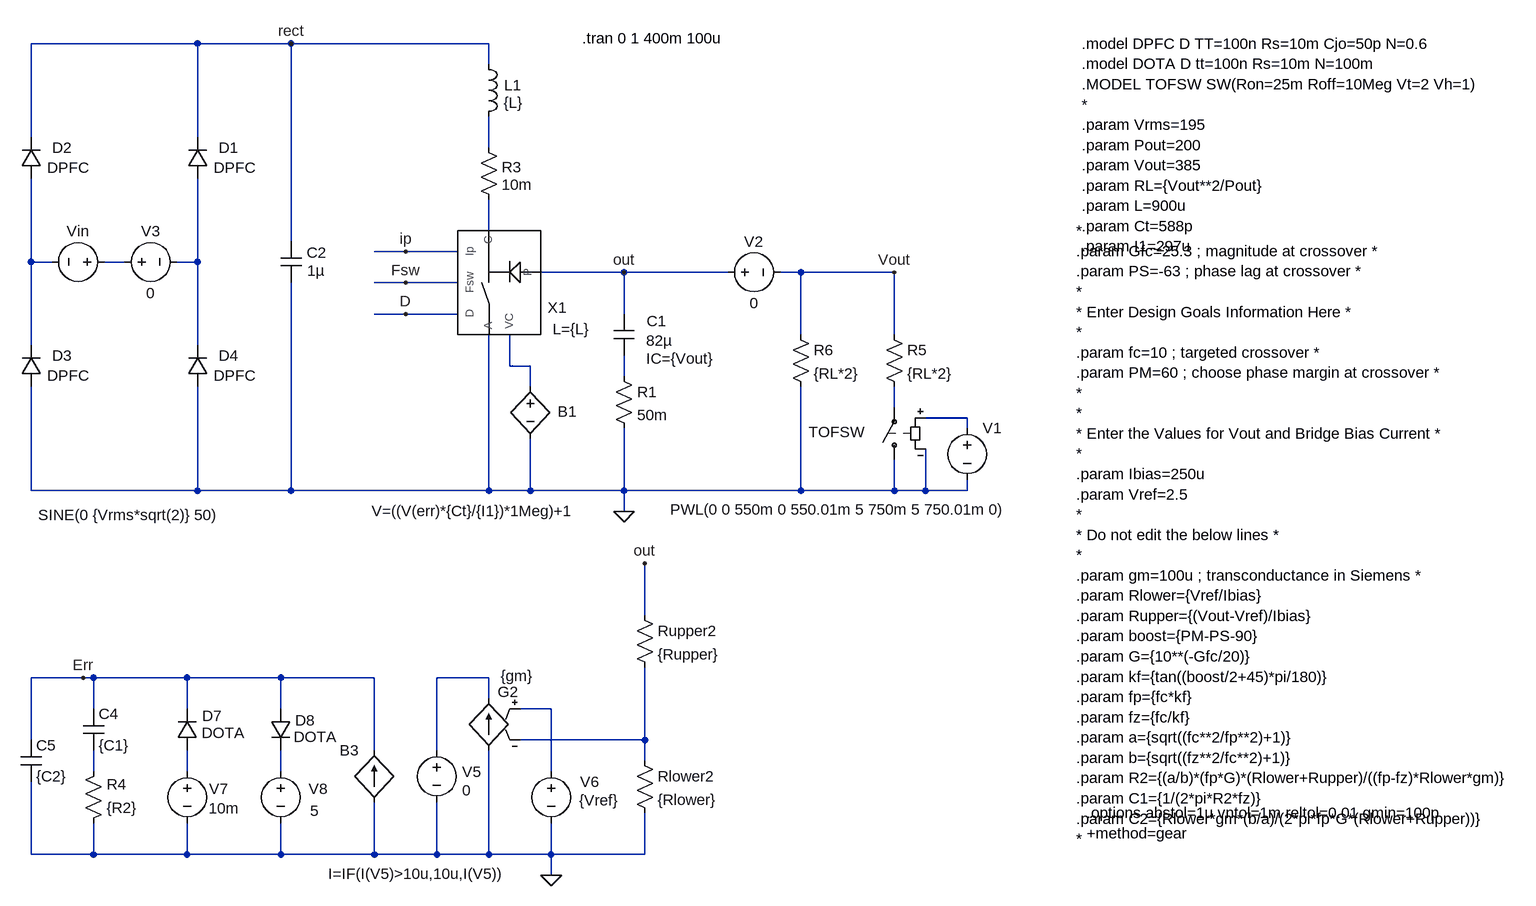
[diagram p0: schematic Boost BCM PFC - VM - avg - load step.asc]
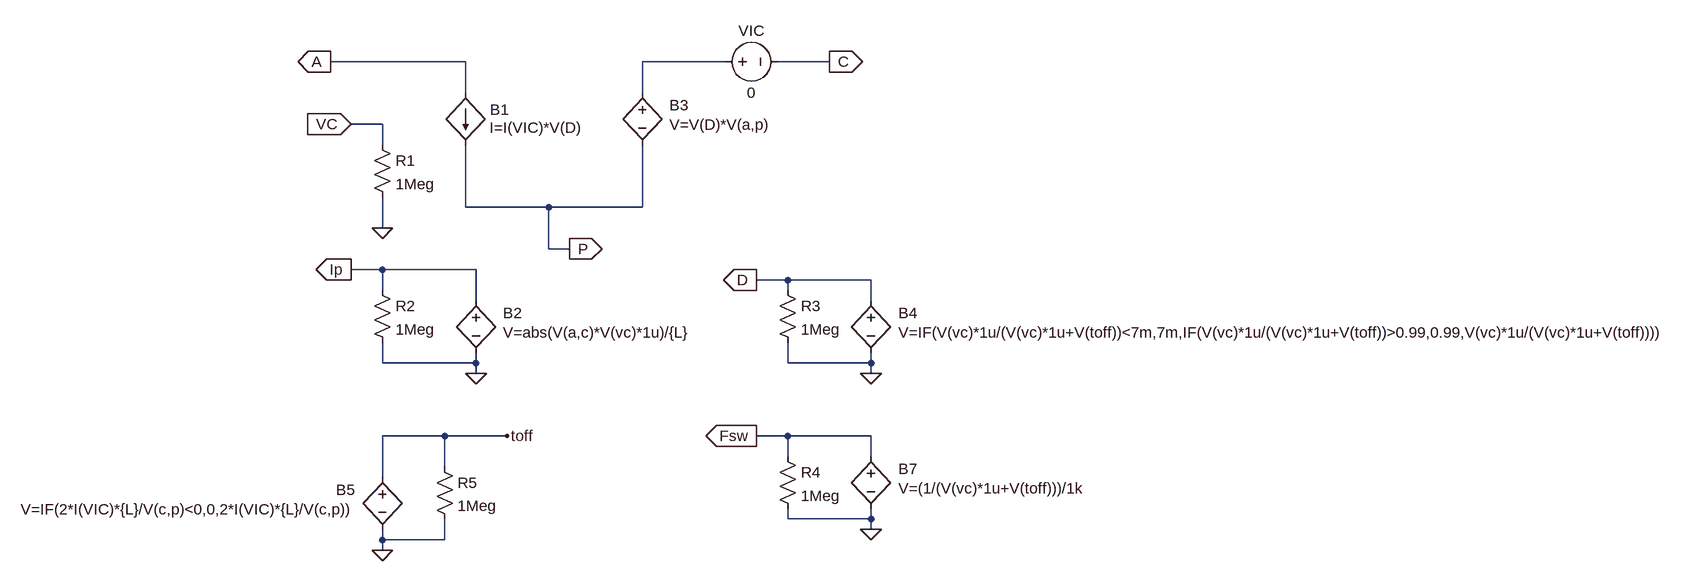
[diagram p1: sub-circuit pwmbcmvm.asc]
Boost BCM PFC - VM - avg - load step.asc, the LTspice schematic file:
Version 4.1
SHEET 1 2292 1108
WIRE -272 -192 -528 -192
WIRE -128 -192 -272 -192
WIRE 176 -192 -128 -192
WIRE 176 -160 176 -192
WIRE -528 -48 -528 -192
WIRE -272 -48 -272 -192
WIRE 176 -32 176 -80
WIRE 176 96 176 48
WIRE -128 112 -128 -192
WIRE 48 128 0 128
WIRE 128 128 48 128
WIRE -528 144 -528 16
WIRE -496 144 -528 144
WIRE -384 144 -416 144
WIRE -272 144 -272 16
WIRE -272 144 -304 144
WIRE 384 160 256 160
WIRE 544 160 384 160
WIRE 656 160 624 160
WIRE 800 160 656 160
WIRE 48 176 0 176
WIRE 128 176 48 176
WIRE 48 224 0 224
WIRE 128 224 48 224
WIRE 384 224 384 160
WIRE 656 256 656 160
WIRE 800 256 800 160
WIRE -528 272 -528 144
WIRE -272 272 -272 144
WIRE 208 304 208 256
WIRE 240 304 208 304
WIRE 384 320 384 288
WIRE 240 336 240 304
WIRE 800 368 800 336
WIRE 912 384 848 384
WIRE 912 400 912 384
WIRE -528 496 -528 336
WIRE -272 496 -272 336
WIRE -272 496 -528 496
WIRE -128 496 -128 176
WIRE -128 496 -272 496
WIRE 176 496 176 256
WIRE 176 496 -128 496
WIRE 240 496 240 416
WIRE 240 496 176 496
WIRE 384 496 384 400
WIRE 384 496 240 496
WIRE 656 496 656 336
WIRE 656 496 384 496
WIRE 800 496 800 448
WIRE 800 496 656 496
WIRE 848 496 848 432
WIRE 848 496 800 496
WIRE 912 496 912 480
WIRE 912 496 848 496
WIRE 384 528 384 496
WIRE 416 688 416 608
WIRE -448 784 -528 784
WIRE -432 784 -448 784
WIRE -288 784 -432 784
WIRE -144 784 -288 784
WIRE 0 784 -144 784
WIRE 176 784 96 784
WIRE 176 816 176 784
WIRE -432 832 -432 784
WIRE -288 832 -288 784
WIRE -144 832 -144 784
WIRE 272 832 224 832
WIRE -528 880 -528 784
WIRE 416 880 416 768
WIRE 416 880 224 880
WIRE 0 896 0 784
WIRE 96 896 96 784
WIRE 416 912 416 880
WIRE -432 928 -432 896
WIRE -288 928 -288 896
WIRE -144 928 -144 896
WIRE 272 928 272 832
WIRE -528 1056 -528 944
WIRE -432 1056 -432 1008
WIRE -432 1056 -528 1056
WIRE -288 1056 -288 1008
WIRE -288 1056 -432 1056
WIRE -144 1056 -144 1008
WIRE -144 1056 -288 1056
WIRE 0 1056 0 976
WIRE 0 1056 -144 1056
WIRE 96 1056 96 976
WIRE 96 1056 0 1056
WIRE 176 1056 176 896
WIRE 176 1056 96 1056
WIRE 272 1056 272 1008
WIRE 272 1056 176 1056
WIRE 416 1056 416 992
WIRE 416 1056 272 1056
WIRE 272 1088 272 1056
FLAG 384 528 0
FLAG 384 160 out
FLAG -128 -192 rect
FLAG 48 128 ip
FLAG 48 176 Fsw
FLAG 48 224 D
FLAG 272 1088 0
FLAG -448 784 Err
FLAG 416 608 out
FLAG 800 160 Vout
DATAFLAG 480 160 ""
DATAFLAG 0 128 ""
DATAFLAG 16 176 ""
DATAFLAG 16 224 ""
DATAFLAG 352 880 ""
SYMBOL PWMBCMVM 192 192 R270
WINDOW 0 -7 89 VBottom 2
WINDOW 39 -40 111 VBottom 2
SYMATTR InstName X1
SYMATTR SpiceLine L={L}
SYMBOL cap 368 224 R0
WINDOW 0 51 11 Left 2
WINDOW 3 50 41 Left 2
WINDOW 123 50 69 Left 2
SYMATTR InstName C1
SYMATTR Value 82µ
SYMATTR Value2 IC={Vout}
SYMBOL res 368 304 R0
SYMATTR InstName R1
SYMATTR Value 50m
SYMBOL res 160 -48 R0
WINDOW 0 36 46 Left 2
WINDOW 3 36 73 Left 2
SYMATTR InstName R3
SYMATTR Value 10m
SYMBOL ind 160 -176 R0
WINDOW 0 40 48 Left 2
WINDOW 3 39 75 Left 2
SYMATTR InstName L1
SYMATTR Value {L}
SYMBOL cap -144 112 R0
WINDOW 0 40 18 Left 2
WINDOW 3 41 45 Left 2
SYMATTR InstName C2
SYMATTR Value 1µ
SYMBOL diode -256 16 R180
WINDOW 0 -47 48 Left 2
WINDOW 3 -74 17 Left 2
SYMATTR InstName D1
SYMATTR Value DPFC
SYMBOL diode -512 16 R180
WINDOW 0 -47 48 Left 2
WINDOW 3 -74 17 Left 2
SYMATTR InstName D2
SYMATTR Value DPFC
SYMBOL diode -512 336 R180
WINDOW 0 -47 48 Left 2
WINDOW 3 -74 17 Left 2
SYMATTR InstName D3
SYMATTR Value DPFC
SYMBOL diode -256 336 R180
WINDOW 0 -47 48 Left 2
WINDOW 3 -74 17 Left 2
SYMATTR InstName D4
SYMATTR Value DPFC
SYMBOL voltage -400 144 R90
WINDOW 0 -32 56 VBottom 2
WINDOW 3 374 -22 VTop 2
WINDOW 123 0 0 Left 0
WINDOW 39 0 0 Left 0
SYMATTR InstName Vin
SYMATTR Value SINE(0 {Vrms*sqrt(2)} 50)
SYMBOL voltage -400 144 R270
WINDOW 0 32 56 VTop 2
WINDOW 3 -32 56 VBottom 2
WINDOW 123 0 0 Left 0
WINDOW 39 0 0 Left 0
SYMATTR InstName V3
SYMATTR Value 0
SYMBOL bv 240 320 R0
WINDOW 0 42 54 Left 2
WINDOW 3 -244 207 Left 2
SYMATTR InstName B1
SYMATTR Value V=((V(err)*{Ct}/{I1})*1Meg)+1
SYMBOL res 400 896 R0
SYMATTR InstName Rlower2
SYMATTR Value {Rlower}
SYMBOL res 400 672 R0
SYMATTR InstName Rupper2
SYMATTR Value {Rupper}
SYMBOL voltage 272 912 R0
WINDOW 0 45 32 Left 2
WINDOW 3 43 61 Left 2
WINDOW 123 0 0 Left 0
WINDOW 39 0 0 Left 0
SYMATTR InstName V6
SYMATTR Value {Vref}
SYMBOL g 176 800 M0
WINDOW 0 -46 6 Left 2
WINDOW 3 -69 -19 Left 2
SYMATTR InstName G2
SYMATTR Value {gm}
SYMBOL diode -272 896 R180
WINDOW 0 -38 53 Left 2
WINDOW 3 -73 27 Left 2
SYMATTR InstName D7
SYMATTR Value DOTA
SYMBOL diode -160 832 R0
WINDOW 0 38 18 Left 2
WINDOW 3 36 43 Left 2
SYMATTR InstName D8
SYMATTR Value DOTA
SYMBOL voltage -288 912 R0
WINDOW 0 34 43 Left 2
WINDOW 3 33 73 Left 2
WINDOW 123 0 0 Left 0
WINDOW 39 0 0 Left 0
SYMATTR InstName V7
SYMATTR Value 10m
SYMBOL voltage -144 912 R0
WINDOW 0 43 43 Left 2
WINDOW 3 45 77 Left 2
SYMATTR InstName V8
SYMATTR Value 5
SYMBOL voltage 96 880 R0
WINDOW 0 39 49 Left 2
WINDOW 3 39 77 Left 2
SYMATTR InstName V5
SYMATTR Value 0
SYMBOL bi 0 976 R180
WINDOW 0 24 80 Left 2
WINDOW 3 -202 -110 Left 2
SYMATTR InstName B3
SYMATTR Value I=IF(I(V5)>10u,10u,I(V5))
SYMBOL cap -448 896 M180
WINDOW 0 24 56 Left 2
WINDOW 3 24 8 Left 2
SYMATTR InstName C4
SYMATTR Value {C1}
SYMBOL res -448 1024 M180
WINDOW 0 36 76 Left 2
WINDOW 3 36 40 Left 2
SYMATTR InstName R4
SYMATTR Value {R2}
SYMBOL cap -544 944 M180
WINDOW 0 24 56 Left 2
WINDOW 3 24 8 Left 2
SYMATTR InstName C5
SYMATTR Value {C2}
SYMBOL sw 800 464 R180
WINDOW 3 47 44 Invisible 2
WINDOW 0 45 58 Left 2
SYMATTR Value TOFSW
SYMATTR InstName TOFSW
SYMBOL res 784 240 R0
SYMATTR InstName R5
SYMATTR Value {RL*2}
SYMBOL res 640 240 R0
SYMATTR InstName R6
SYMATTR Value {RL*2}
SYMBOL voltage 912 384 R0
WINDOW 3 -457 141 Left 2
WINDOW 123 0 0 Left 0
WINDOW 39 0 0 Left 0
SYMATTR Value PWL(0 0 550m 0 550.01m 5 750m 5 750.01m 0)
SYMATTR InstName V1
SYMBOL voltage 528 160 R270
WINDOW 0 32 56 VTop 2
WINDOW 3 -32 56 VBottom 2
SYMATTR InstName V2
SYMATTR Value 0
TEXT 1088 -192 Left 2 !.model DPFC D TT=100n Rs=10m Cjo=50p N=0.6\n.model DOTA D tt=100n Rs=10m N=100m\n.MODEL TOFSW SW(Ron=25m Roff=10Meg Vt=2 Vh=1)\n*\n.param Vrms=195\n.param Pout=200\n.param Vout=385\n.param RL={Vout**2/Pout}\n.param L=900u\n.param Ct=588p\n.param I1=297u
TEXT 320 -200 Left 2 !.tran 0 1 400m 100u
TEXT 1096 992 Left 2 !.options abstol=1u vntol=1m reltol=0.01 gmin=100p\n+method=gear
TEXT 1080 96 Left 2 !*\n.param Gfc=25.3 ; magnitude at crossover *\n.param PS=-63 ; phase lag at crossover *\n*\n* Enter Design Goals Information Here *\n*\n.param fc=10 ; targeted crossover *\n.param PM=60 ; choose phase margin at crossover *\n*\n*\n* Enter the Values for Vout and Bridge Bias Current *\n*\n.param Ibias=250u\n.param Vref=2.5\n*\n* Do not edit the below lines *\n*\n.param gm=100u ; transconductance in Siemens *\n.param Rlower={Vref/Ibias}\n.param Rupper={(Vout-Vref)/Ibias}\n.param boost={PM-PS-90}\n.param G={10**(-Gfc/20)}\n.param kf={tan((boost/2+45)*pi/180)}\n.param fp={fc*kf}\n.param fz={fc/kf}\n.param a={sqrt((fc**2/fp**2)+1)}\n.param b={sqrt((fz**2/fc**2)+1)}\n.param R2={(a/b)*(fp*G)*(Rlower+Rupper)/((fp-fz)*Rlower*gm)}\n.param C1={1/(2*pi*R2*fz)}\n.param C2={Rlower*gm*(b/a)/(2*pi*fp*G*(Rlower+Rupper))}\n*

pwmbcmvm.asc, the sub-circuit schematic file:
Version 4
SHEET 1 2112 820
WIRE 64 48 -144 48
WIRE 464 48 336 48
WIRE 624 48 544 48
WIRE 64 96 64 48
WIRE 336 96 336 48
WIRE -64 144 -112 144
WIRE -64 176 -64 144
WIRE 64 272 64 176
WIRE 192 272 64 272
WIRE 336 272 336 176
WIRE 336 272 192 272
WIRE -64 304 -64 256
WIRE 192 336 192 272
WIRE 224 336 192 336
WIRE -64 368 -112 368
WIRE 80 368 -64 368
WIRE 560 384 512 384
WIRE 688 384 560 384
WIRE -64 400 -64 368
WIRE 560 400 560 384
WIRE 80 416 80 368
WIRE 688 416 688 384
WIRE -64 512 -64 480
WIRE 80 512 80 496
WIRE 80 512 -64 512
WIRE 560 512 560 480
WIRE 688 512 688 496
WIRE 688 512 560 512
WIRE 80 528 80 512
WIRE 688 528 688 512
WIRE 32 624 -64 624
WIRE 128 624 32 624
WIRE 560 624 512 624
WIRE 688 624 560 624
WIRE 560 656 560 624
WIRE 688 656 688 624
WIRE 32 672 32 624
WIRE -64 688 -64 624
WIRE 560 752 560 736
WIRE 688 752 688 736
WIRE 688 752 560 752
WIRE 688 768 688 752
WIRE -64 784 -64 768
WIRE 32 784 32 752
WIRE 32 784 -64 784
WIRE -64 800 -64 784
FLAG 80 528 0
FLAG -144 48 A
IOPIN -144 48 Out
FLAG 624 48 C
IOPIN 624 48 Out
FLAG 224 336 P
IOPIN 224 336 Out
FLAG -112 368 Ip
IOPIN -112 368 Out
FLAG 688 528 0
FLAG 512 384 D
IOPIN 512 384 Out
FLAG -64 800 0
FLAG 128 624 toff
FLAG 512 624 Fsw
IOPIN 512 624 Out
FLAG 688 768 0
FLAG -64 304 0
FLAG -112 144 VC
IOPIN -112 144 In
SYMBOL bi 64 96 R0
WINDOW 0 38 26 Left 2
WINDOW 3 37 53 Left 2
SYMATTR InstName B1
SYMATTR Value I=I(VIC)*V(D)
SYMBOL bv 80 400 R0
WINDOW 0 42 35 Left 2
WINDOW 3 42 65 Left 2
SYMATTR InstName B2
SYMATTR Value V=abs(V(a,c)*V(vc)*1u)/{L}
SYMBOL voltage 448 48 R270
WINDOW 0 32 56 VTop 2
WINDOW 3 -32 56 VBottom 2
WINDOW 123 0 0 Left 0
WINDOW 39 0 0 Left 0
SYMATTR InstName VIC
SYMATTR Value 0
SYMBOL bv 688 400 R0
WINDOW 0 42 35 Left 2
WINDOW 3 42 65 Left 2
SYMATTR InstName B4
SYMATTR Value V=IF(V(vc)*1u/(V(vc)*1u+V(toff))<7m,7m,IF(V(vc)*1u/(V(vc)*1u+V(toff))>0.99,0.99,V(vc)*1u/(V(vc)*1u+V(toff))))
SYMBOL bv -64 672 M0
WINDOW 0 42 35 Left 2
WINDOW 3 42 65 Left 2
SYMATTR InstName B5
SYMATTR Value V=IF(2*I(VIC)*{L}/V(c,p)<0,0,2*I(VIC)*{L}/V(c,p))
SYMBOL bv 688 640 R0
WINDOW 0 42 35 Left 2
WINDOW 3 42 65 Left 2
SYMATTR InstName B7
SYMATTR Value V=(1/(V(vc)*1u+V(toff)))/1k
SYMBOL bv 336 80 R0
WINDOW 0 42 35 Left 2
WINDOW 3 42 65 Left 2
SYMATTR InstName B3
SYMATTR Value V=V(D)*V(a,p)
SYMBOL res -80 160 R0
SYMATTR InstName R1
SYMATTR Value 1Meg
SYMBOL res -80 384 R0
SYMATTR InstName R2
SYMATTR Value 1Meg
SYMBOL res 544 384 R0
SYMATTR InstName R3
SYMATTR Value 1Meg
SYMBOL res 544 640 R0
SYMATTR InstName R4
SYMATTR Value 1Meg
SYMBOL res 16 656 R0
SYMATTR InstName R5
SYMATTR Value 1Meg

The netlist it stands for:
* Boost BCM PFC - VM - avg - load step.asc
X§X1 N006 0 N002 out ip Fsw D pwmbcmvm params: L={L}
C1 out N007 82µ IC={Vout}
R1 N007 0 50m
R3 N001 N002 10m
L1 rect N001 {L}
C2 rect 0 1µ
D1 N005 rect DPFC
D2 N003 rect DPFC
D3 0 N003 DPFC
D4 0 N005 DPFC
Vin N004 N003 SINE(0 {Vrms*sqrt(2)} 50)
V3 N004 N005 0
B1 N006 0 V=((V(err)*{Ct}/{I1})*1Meg)+1
Rlower2 N012 0 {Rlower}
Rupper2 out N012 {Rupper}
V6 N011 0 {Vref}
G2 0 N010 N011 N012 {gm}
D7 N014 Err DOTA
D8 Err N015 DOTA
V7 N014 0 10m
V8 N015 0 5
V5 N010 0 0
B3 0 Err I=IF(I(V5)>10u,10u,I(V5))
C4 N013 Err {C1}
R4 0 N013 {R2}
C5 0 Err {C2}
S§TOFSW 0 N008 N009 0 TOFSW
R5 Vout N008 {RL*2}
R6 Vout 0 {RL*2}
V1 N009 0 PWL(0 0 550m 0 550.01m 5 750m 5 750.01m 0)
V2 out Vout 0

* block symbol definitions
.subckt pwmbcmvm VC A C P Ip Fsw D
B1 A P I=I(VIC)*V(D)
B2 Ip 0 V=abs(V(a,c)*V(vc)*1u)/{L}
VIC N001 C 0
B4 D 0 V=IF(V(vc)*1u/(V(vc)*1u+V(toff))<7m,7m,IF(V(vc)*1u/(V(vc)*1u+V(toff))>0.99,0.99,V(vc)*1u/(V(vc)*1u+V(toff))))
B5 toff 0 V=IF(2*I(VIC)*{L}/V(c,p)<0,0,2*I(VIC)*{L}/V(c,p))
B7 Fsw 0 V=(1/(V(vc)*1u+V(toff)))/1k
B3 N001 P V=V(D)*V(a,p)
R1 VC 0 1Meg
R2 Ip 0 1Meg
R3 D 0 1Meg
R4 Fsw 0 1Meg
R5 toff 0 1Meg
.ends pwmbcmvm

.model D D
.lib standard.dio
.model DPFC D TT=100n Rs=10m Cjo=50p N=0.6
.model DOTA D tt=100n Rs=10m N=100m
.MODEL TOFSW SW(Ron=25m Roff=10Meg Vt=2 Vh=1)
*
.param Vrms=195
.param Pout=200
.param Vout=385
.param RL={Vout**2/Pout}
.param L=900u
.param Ct=588p
.param I1=297u
.tran 0 1 400m 100u
.options abstol=1u vntol=1m reltol=0.01 gmin=100p
+method=gear
*
.param Gfc=25.3 ; magnitude at crossover *
.param PS=-63 ; phase lag at crossover *
*
* Enter Design Goals Information Here *
*
.param fc=10 ; targeted crossover *
.param PM=60 ; choose phase margin at crossover *
*
*
* Enter the Values for Vout and Bridge Bias Current *
*
.param Ibias=250u
.param Vref=2.5
*
* Do not edit the below lines *
*
.param gm=100u ; transconductance in Siemens *
.param Rlower={Vref/Ibias}
.param Rupper={(Vout-Vref)/Ibias}
.param boost={PM-PS-90}
.param G={10**(-Gfc/20)}
.param kf={tan((boost/2+45)*pi/180)}
.param fp={fc*kf}
.param fz={fc/kf}
.param a={sqrt((fc**2/fp**2)+1)}
.param b={sqrt((fz**2/fc**2)+1)}
.param R2={(a/b)*(fp*G)*(Rlower+Rupper)/((fp-fz)*Rlower*gm)}
.param C1={1/(2*pi*R2*fz)}
.param C2={Rlower*gm*(b/a)/(2*pi*fp*G*(Rlower+Rupper))}
*
.backanno
.end